# Altium schematic sheet Pico.SchDoc
size A; SheetNumber: 4; SheetTotal: 7
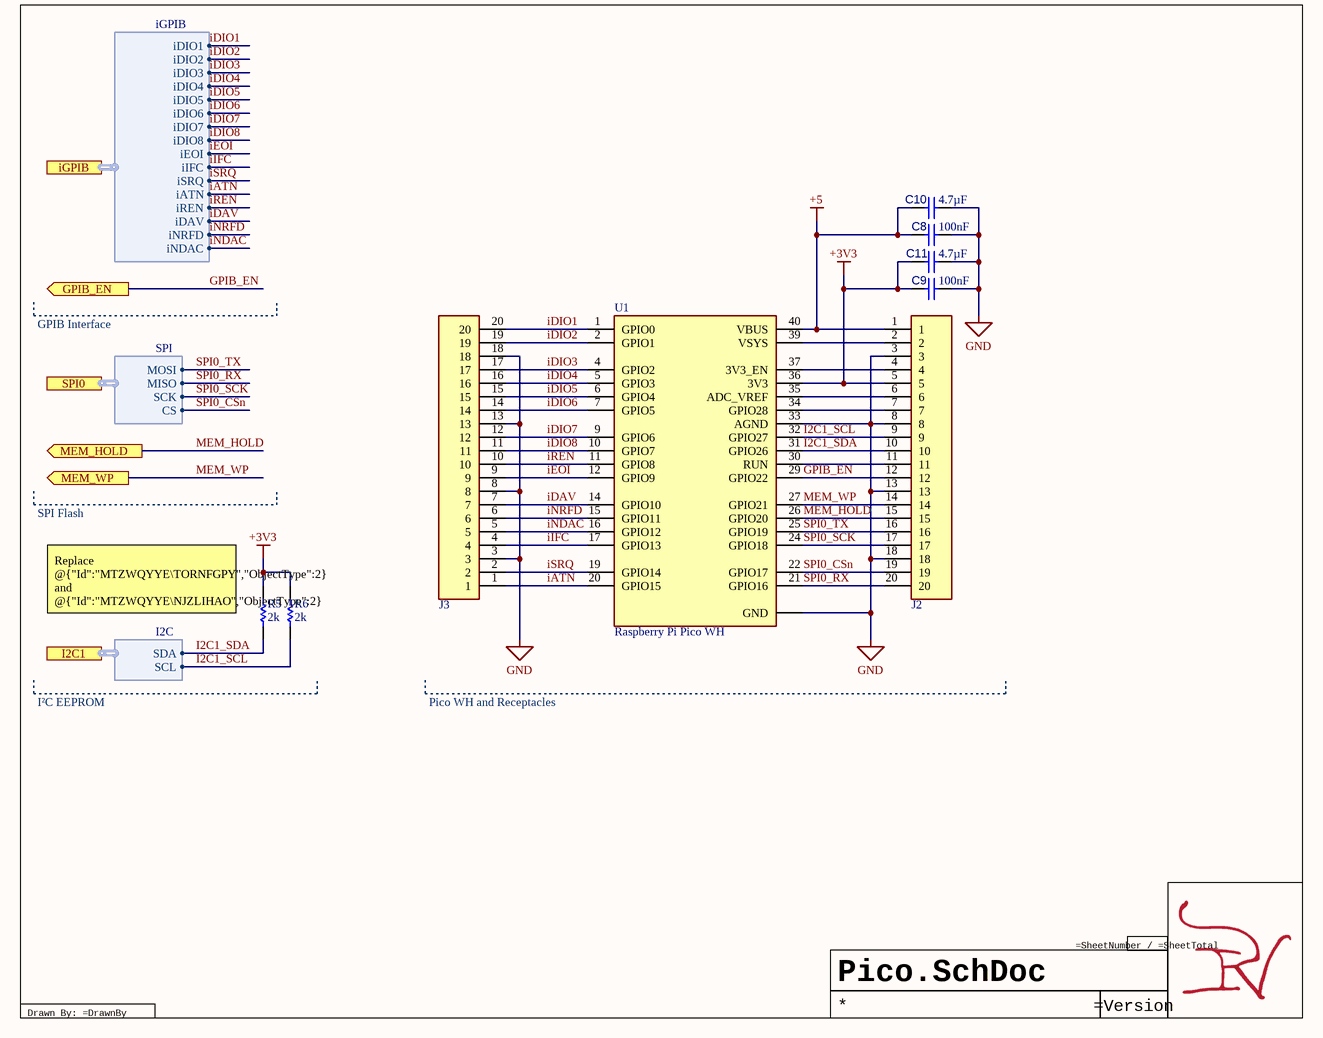
[diagram p0: Pico.SchDoc]

## Parts
C8  value 100nF  [CAP 0402_1005]  (hidden comment: CAP-NP-2)
C9  value 100nF  [CAP 0402_1005]  (hidden comment: CAP-NP-2)
C10  value 4.7µF  [CAP 0402_1005]  (hidden comment: CL05A475MP5NRNC)
C11  value 4.7µF  [CAP 0402_1005]  (hidden comment: CL05A475MP5NRNC)
J2  MDF7-20S-2.54DSA  [MDF720S254DSA55]  (value not drawn)
J3  MDF7-20S-2.54DSA  [MDF720S254DSA55]  (value not drawn)
R5  value 2k  [RES 0402_1005]  (hidden comment: 2K-0402-0.1/1)
R6  value 2k  [RES 0402_1005]  (hidden comment: 2K-0402-0.1/1)
U1  Raspberry Pi Pico WH  [RASPBERRYPIPICOWH-Footprint-1]

## Ports
GPIB_EN (out), I2C1 (harness I2C), iGPIB (harness iGPIB), MEM_HOLD (out), MEM_WP (out), SPI0 (harness SPI)

## Harnesses
iGPIB: iEOI, iIFC, iSRQ, iATN, iREN, iDAV, iNRFD, iNDAC, iDIO8, iDIO7, iDIO6, iDIO5, iDIO4, iDIO3, iDIO2, iDIO1
SPI: MOSI, MISO, SCK, CS
I2C: SDA, SCL

## Nets
+3V3: C9.2 C11.2 J2.5 R5.2 R6.2 U1.36(3V3)
+5: C8.2 C10.2 J2.1 U1.40(VBUS)
GND: C8.1 C9.1 C10.1 C11.1 J2.3 J2.8 J2.13 J2.18 J3.3 J3.8 J3.13 J3.18 U1.3,_8,_13,_18,_23,_28,_38(GND) U1.33(AGND)
GPIB_EN: J2.12 U1.29(GPIO22) ; port GPIB_EN
I2C1_SCL: J2.9 R6.1 U1.32(GPIO27) ; port I2C1.SCL
I2C1_SDA: J2.10 R5.1 U1.31(GPIO26) ; port I2C1.SDA
iATN: J3.1 U1.20(GPIO15) ; port iGPIB.iATN
iDAV: J3.7 U1.14(GPIO10) ; port iGPIB.iDAV
iDIO1: J3.20 U1.1(GPIO0) ; port iGPIB.iDIO1
iDIO2: J3.19 U1.2(GPIO1) ; port iGPIB.iDIO2
iDIO3: J3.17 U1.4(GPIO2) ; port iGPIB.iDIO3
iDIO4: J3.16 U1.5(GPIO3) ; port iGPIB.iDIO4
iDIO5: J3.15 U1.6(GPIO4) ; port iGPIB.iDIO5
iDIO6: J3.14 U1.7(GPIO5) ; port iGPIB.iDIO6
iDIO7: J3.12 U1.9(GPIO6) ; port iGPIB.iDIO7
iDIO8: J3.11 U1.10(GPIO7) ; port iGPIB.iDIO8
iEOI: J3.9 U1.12(GPIO9) ; port iGPIB.iEOI
iIFC: J3.4 U1.17(GPIO13) ; port iGPIB.iIFC
iNDAC: J3.5 U1.16(GPIO12) ; port iGPIB.iNDAC
iNRFD: J3.6 U1.15(GPIO11) ; port iGPIB.iNRFD
iREN: J3.10 U1.11(GPIO8) ; port iGPIB.iREN
iSRQ: J3.2 U1.19(GPIO14) ; port iGPIB.iSRQ
MEM_HOLD: J2.15 U1.26(GPIO20) ; port MEM_HOLD
MEM_WP: J2.14 U1.27(GPIO21) ; port MEM_WP
SPI0_CSn: J2.19 U1.22(GPIO17) ; port SPI0.CS
SPI0_RX: J2.20 U1.21(GPIO16) ; port SPI0.MISO
SPI0_SCK: J2.17 U1.24(GPIO18) ; port SPI0.SCK
SPI0_TX: J2.16 U1.25(GPIO19) ; port SPI0.MOSI
NetJ2_2: J2.2 U1.39(VSYS)
NetJ2_4: J2.4 U1.37(3V3_EN)
NetJ2_6: J2.6 U1.35(ADC_VREF)
NetJ2_7: J2.7 U1.34(GPIO28)
NetJ2_11: J2.11 U1.30(RUN)

## Notes on the sheet
- GPIB Interface
- SPI Flash
- (near R5) Replace @{"Id":"MTZWQYYE\TORNFGPY","ObjectType":2} and @{"Id":"MTZWQYYE\NJZLIHAO","ObjectType":2} to 5K if not using Fast Mode. Low part count may also allow for 10K in any case.
- I²C EEPROM
- Pico WH and Receptacles
- Drawn By: =DrawnBy

## Library data of the parts
C8 C9 = CMP-00000-4: Ceramic Capacitor, Multilayer, Ceramic, 10V, 10% +Tol, 10% -Tol, X7R, 15% TC, 0.1uF, Surface Mount, 0402; Multilayer: Yes; Conflict Mineral: DRC Conflict Undeterminable; Global PFAS Assessment Status: Not Affected; Green: Compliant; NAS411: Affected; Rare Earth Element Information: Rare Earth Free; Capacitor Type: Ceramic; Case/Package: 0402; Dielectric Material: Ceramic; JESD-609 Code: e3; Max Operating Temperature: 125°C; Min Operating Temperature: -55°C; Mounting Technology: Surface Mount; Package Shape: Rectangular; Packaging: Tape and Reel; Pins: 2; Rated DC Voltage (URdc): 10V; Reach SVHC Compliant: Yes; RoHS Compliant: Yes; Temperature Characteristics Code: X7R; Terminal Finish: Nickel; Termination: Wraparound; Tolerance  (fill in as +-): 10%; Tolerance (fill in as +-): 10%; Tolerance: 10%; Voltage Rating: 10V; China RoHS Status: Unaffected; ELV: Compliant; EU SVHC List Version: Jan 23, 2024; Halogen Free: Compliant; Lead Free: Compliant; Persistent Organic Pollutants (POPs): Not Affected; REACH(SVHC) Information: Unaffected; RoHS Status: Yes; RoHS Version: 2011/65/EU, 2015/863; TSCA: Compliant; Capacitance: 100nF; Case Code (Imperial): 0402; Case Code (Metric): 1005; Construction: Flat; Contact Plating: Tin; Depth: 0.5mm; Dielectric: X7R; Height: 0.5mm; Length: 1mm; Mount: Surface Mount; Package Quantity: 1; Package Style: SMTMeter; Radiation Hardening: No; Series: CL; Thickness: 0.022inch; Width: 0.5mm
C10 C11 = CMP-001-00020-1: Ceramic Capacitor, Multilayer, Ceramic, 10V, 20% +Tol, 20% -Tol, X5R, 15% TC, 4.7uF, Surface Mount, 0402; Multilayer: Yes; Terminal Finish: Nickel; JESD-609 Code: e3; Tolerance (fill in as +-): 20%; Case/Package: 0402; Max Operating Temperature: 85°C; Tolerance  (fill in as +-): 20%; Temperature Characteristics Code: X5R; Packaging: Tape and Reel; Mounting Technology: Surface Mount; Width: 0.5mm; Pins: 2; Min Operating Temperature: -55°C; Package Style: SMTMeter; Capacitor Type: Ceramic; RoHS Compliant: Yes; Height: 0.65mm; Rated DC Voltage (URdc): 10V; Termination: Wraparound; Dielectric Material: Ceramic; Reach SVHC Compliant: Yes; Package Shape: Rectangular; Length: 1mm
J2 J3 = CMP-002-00014-1: Board Connector, 20 Contact(s), 1 Row(s), Female, Straight, 0.1 inch Pitch, Solder Terminal, Locking, Black Insulator, Receptacle; Manufacturer_Name: Hirose; Manufacturer_Part_Number: MDF7-20S-2.54DSA(55); IEC Conformance: No; Number of Contacts: 20; Number of Rows Loaded: 1; Option: General Purpose; Mating Information: MULTIPLE MATING PARTS AVAILABLE; Body Breadth: 0.295inch; Body Depth: 0.197inch; Body Length: 2inch; Contact Pattern: RECTANGULAR; Contact Resistance: 30mR; Dielectric Withstanding Voltage (AC): 650V; Durability: 50Cycles; Insulation Resistance: 1GR; Rated Current (Signal): 3A; Reference Standard: UL; Reliability: COMMERCIAL; Mounting Technology: Board; Contact Finish - Mating: NOT SPECIFIED; Contact Gender: Female; Source: SamacSys.SchLib; Mounting Style: STRAIGHT; RoHS Compliant: Yes; Min Operating Temperature: -35°C; Max Operating Temperature: 85°C; Body/Shell Style: RECEPTACLE; MIL Conformance: No; Termination: Solder; Terminal Pitch: 2.54mm; DIN Conformance: No; Connector Type: BOARD CONNECTOR; Filter Feature: No; Mixed Contacts: No; Design Item ID: MDF7-20S-2.54DSA_55_; Datasheet Link: https://datasheet.datasheetarchive.com/originals/distributors/SFDatasheet-7/sf-000141364.pdf; Flammability Rating: UL94 V-0; Height: 5.3mm; Insulation Color: Black; Insulation Material: Polyamide; Mating Contact Pitch: 0.1inch; Mounting Option 1: LOCKING; Mouser Part Number: 798-MDF720S254DSA55; Mouser Price/Stock: https://www.mouser.co.uk/ProductDetail/Hirose-Connector/MDF7-20S-254DSA55?qs=zOgoZG1CgI9V9vKe%252BtgddQ%3D%3D; Number Of Connectors: 1; Terminal Length: 0.118inch
R5 R6 = CMP-009-00034-1: Fixed Resistor, Metal Glaze/thick Film, 0.1W, 2000ohm, 50V, 1% +/-Tol, 100ppm/Cel, Surface Mount, 0402; TSCA: Compliant; Conflict Mineral: DRC Conflict Undeterminable; Package Width: 0.5mm; Rated Temperature: 70°C; Reference Standard: AEC-Q200; Rare Earth Element Information: Rare Earth Free; Package Length: 1mm; Green: Not Compliant; Global PFAS Assessment Status: Not Affected; Package Height: 0.35mm; Temperature Coefficient: 100ppm/°C; Power: 100mW; NAS411: Affected; Lead Free: Not Compliant; Tolerance: 1%; Min Operating Temperature: -55°C; REACH(SVHC) Information: Unaffected; Resistor Type: FIXED RESISTOR; RoHS Compliant: Yes; China RoHS Status: Affected; Reach SVHC Compliant: Yes; Persistent Organic Pollutants (POPs): Compliant; Mounting Technology: Surface Mount; Package Style: SMTMeter; Halogen Free: Compliant; Technology: METAL GLAZE/THICK FILM; Package Shape: Rectangular; EU SVHC List Version: Jan 23, 2024; Working Voltage: 50V; Termination: Wraparound; Pins: 2; Max Operating Temperature: 155°C; Terminal Finish: Nickel; RoHS Status: Yes with Exemption; RoHS Version: 2011/65/EU, 2015/863; Construction: Rectangular; ELV: Not Compliant; Case/Package: 0402; JESD-609 Code: e3; Packaging: Tape and Reel
U1 = CMP-759-000000-4: RASPBERRY PI BOARD, ARM CORTEX-M0+; Silicon Manufacturer: Raspberry Pi; No. of Bits: 32bit; Silicon Family Name: -;...; pin to pad: 3,8,13,18,23,28,38>3+8+13+18+23+28+38; ComponentLink1URL: https://github.com/recursivenomad/ki-lime-pi-pico; ComponentLink1Description: Source; Design Item ID: CMP-00016-14; Source: Main.SCHLIB